# Altium schematic sheet OPAMP_TESTER_4.SchDoc
size A4; SheetNumber: 5; SheetTotal: 5

## Notes on the sheet
- DrawnBy:
- ProjectName:
- Date:
- CheckedBy:
- Size:
- A4
- File:
- Sheet
- of